# EAGLE design BR110_Roco_43889_PLUX22_J1_007_01_11 (EAGLE 5.10)

## Sheet 1 of 2
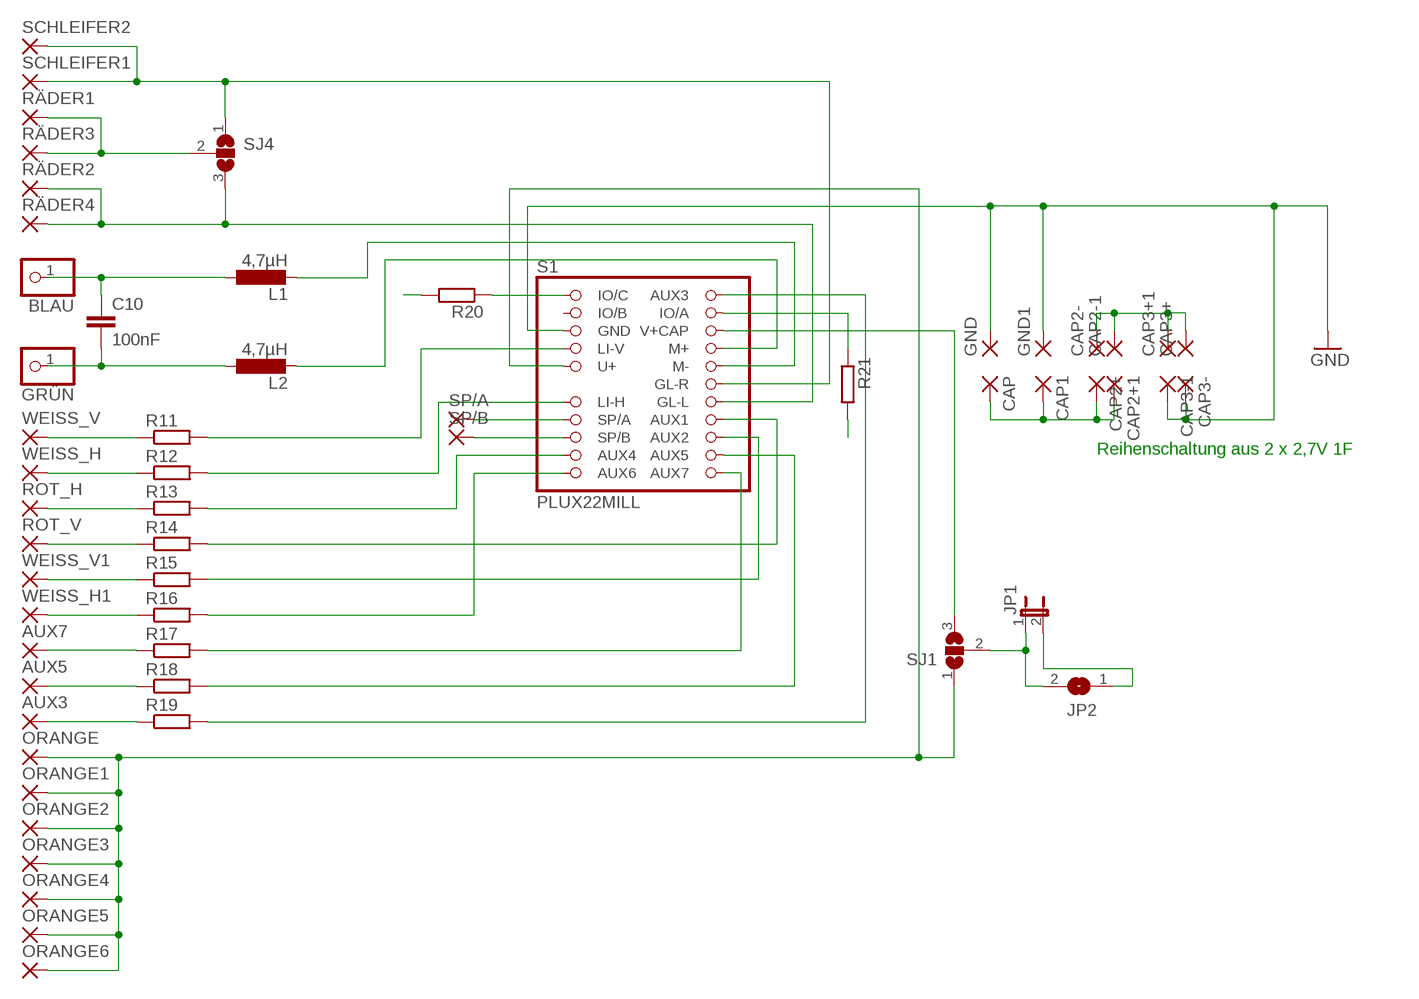
[diagram p0: schematic, sheet 1]

### Parts
AUX3  SMD2  [SMD1,27-2,54]
AUX5  SMD2  [SMD1,27-2,54]
AUX7  SMD2  [SMD1,27-2,54]
BLAU  PINHD-1X1  [1X01]
C10  100nF  C-EUC0603  [C0603]
CAP  SMD2  [SMD1,27-2,54]
CAP1  SMD2  [SMD1,27-2,54]
CAP2+  SMD2  [SMD1,27-2,54]
CAP2+1  SMD2  [SMD1,27-2,54]
CAP2-  SMD2  [SMD1,27-2,54]
CAP2-1  SMD2  [SMD1,27-2,54]
CAP3+  SMD2  [SMD1,27-2,54]
CAP3+1  SMD2  [SMD1,27-2,54]
CAP3-  SMD2  [SMD1,27-2,54]
CAP3-1  SMD2  [SMD1,27-2,54]
GND  SMD2  [SMD1,27-2,54]
GND1  SMD2  [SMD1,27-2,54]
GRÜN  PINHD-1X1  [1X01]
JP1  JP1E2,00  [JP1_2]
JP2  SJ"  [SJ]
L1  4,7µH  L-EUL1212  [L1212]
L2  4,7µH  L-EUL1212  [L1212]
ORANGE  SMD2  [SMD1,27-2,54]
ORANGE1  SMD2  [SMD1,27-2,54]
ORANGE2  SMD2  [SMD1,27-2,54]
ORANGE3  SMD2  [SMD1,27-2,54]
ORANGE4  SMD2  [SMD1,27-2,54]
ORANGE5  SMD2  [SMD1,27-2,54]
ORANGE6  SMD2  [SMD1,27-2,54]
R11  R-EU_R0603S  [R0603S]
R12  R-EU_R0603S  [R0603S]
R13  R-EU_R0603S  [R0603S]
R14  R-EU_R0603S  [R0603S]
R15  R-EU_R0603S  [R0603S]
R16  R-EU_R0603S  [R0603S]
R17  R-EU_R0603S  [R0603S]
R18  R-EU_R0603S  [R0603S]
R19  R-EU_R0603S  [R0603S]
R20  R-EU_R0603S  [R0603S]
R21  R-EU_R0603S  [R0603S]
ROT_H  SMD2  [SMD1,27-2,54]
ROT_V  SMD2  [SMD1,27-2,54]
RÄDER1  SMD2  [SMD1,27-2,54]
RÄDER2  SMD2  [SMD1,27-2,54]
RÄDER3  SMD2  [SMD1,27-2,54]
RÄDER4  SMD2  [SMD1,27-2,54]
S1  PLUX22MILL  [PLUX22_SMD_MILL]
SCHLEIFER1  SMD2  [SMD1,27-2,54]
SCHLEIFER2  SMD2  [SMD1,27-2,54]
SJ1  SJ2W  [SJ_2]
SJ4  SJ2W  [SJ_2]
SP/A  SMD2  [SMD1,27-2,54]
SP/B  SMD2  [SMD1,27-2,54]
WEISS_H  SMD2  [SMD1,27-2,54]
WEISS_H1  SMD2  [SMD1,27-2,54]
WEISS_V  SMD2  [SMD1,27-2,54]
WEISS_V1  SMD2  [SMD1,27-2,54]

### Nets
AUX1: R14.2 S1.P16(AUX1)
AUX2: R15.2 S1.P18(AUX2)
AUX3: R19.2 S1.P2(AUX3)
AUX4: R13.2 S1.P19(AUX4)
AUX5: R18.2 S1.P20(AUX5)
AUX6: R16.2 S1.P21(AUX6)
AUX7: R17.2 S1.P22(AUX7)
BLAU: BLAU.1 C10.1 L1.1
CAP: CAP1.1(P) CAP2+1.1(P) CAP2+.1(P) CAP.1(P) ; also sheet 2
FÜ1: R21.2
FÜ2: R20.2
GND: CAP3-1.1(P) CAP3-.1(P) GND1.1(P) GND.1(P) S1.P5(GND) ; also sheet 2
GRAU: R11.2 S1.P7(LI-V)
GRÜN: C10.2 GRÜN.1 L2.1
IN: JP1.2 JP2.1 ; also sheet 2
N$2: S1.P6(V+CAP) SJ1.3
N$3: AUX7.1(P) R17.1
N$4: AUX5.1(P) R18.1
N$5: AUX3.1(P) R19.1
N$6: R12.2 S1.P13(LI-H)
N$8: R13.1 ROT_H.1(P)
N$9: R14.1 ROT_V.1(P)
N$10: R12.1 WEISS_H.1(P)
N$11: R11.1 WEISS_V.1(P)
N$16: R21.1 S1.P4(IO/A)
N$17: S1.P15(SP/A) SP/A.1(P)
N$18: S1.P17(SP/B) SP/B.1(P)
N$20: R15.1 WEISS_V1.1(P)
N$21: R16.1 WEISS_H1.1(P)
N$22: L2.2 S1.P8(M+)
N$23: L1.2 S1.P10(M-)
N$24: R20.1 S1.P1(IO/C)
N$27: CAP2-1.1(P) CAP2-.1(P) CAP3+1.1(P) CAP3+.1(P)
N$35: JP1.1 JP2.2 SJ1.2
ORANGE: ORANGE1.1(P) ORANGE2.1(P) ORANGE3.1(P) ORANGE4.1(P) ORANGE5.1(P) ORANGE6.1(P) ORANGE.1(P) S1.P9(U+) SJ1.1
RÄDER: RÄDER2.1(P) RÄDER4.1(P) S1.P14(GL-L) SJ4.3
RÄDER2: RÄDER1.1(P) RÄDER3.1(P) SJ4.2
SCHLEIFER: S1.P12(GL-R) SCHLEIFER1.1(P) SCHLEIFER2.1(P) SJ4.1
Unconnected: S1.P3(IO/B)

### Notes on the sheet
- Reihenschaltung aus 2 x 2,7V 1F

## Sheet 2 of 2
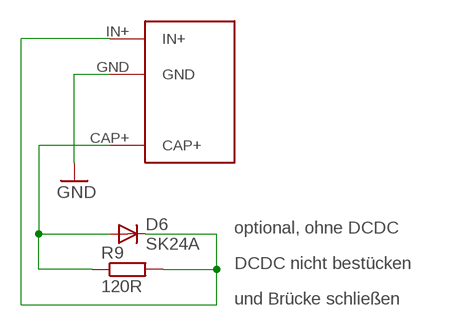
[diagram p1: schematic, sheet 2]

### Parts
D6  SK24A  ES2D  [SMB]
R9  120R  R-EU_R0603  [R0603]
U$1  PWR_CAPT  [POWER_CAP]

### Nets
CAP: D6.A R9.1 U$1.CAP+ ; also sheet 1
GND: U$1.GND ; also sheet 1
IN: D6.C R9.2 U$1.IN+ ; also sheet 1

### Notes on the sheet
- optional, ohne DCDC
- DCDC nicht bestücken
- und Brücke schließen

## Library data of the parts
AUX3 AUX5 AUX7 CAP CAP1 CAP2+ CAP2+1 CAP2- CAP2-1 CAP3+ CAP3+1 CAP3- CAP3-1 GND GND1 ORANGE ORANGE1-ORANGE6 ROT_H ROT_V RÄDER1-RÄDER4 SCHLEIFER1 SCHLEIFER2 SP/A SP/B WEISS_H WEISS_H1 WEISS_V WEISS_V1 = wirepad:SMD2: SMD PAD
BLAU GRÜN = pinhead:PINHD-1X1: PIN HEADER
C10 = rcl:C-EU: CAPACITOR, European symbol
D6 = diode:ES2D: DIODE super fast rectifier, 2 A
JP1 = jumper:JP1E: JUMPER
JP2 = jumper:SJ: SMD solder JUMPER
L1 L2 = rcl:L-EU: INDUCTOR, European symbol
R9 R11-R21 = rcl:R-EU_: RESISTOR, European symbol
S1 = pinhead:PLUX22
SJ1 SJ4 = jumper:SJ2W: SMD solder JUMPER
U$1 = pinhead:PWR_CAP

## Board
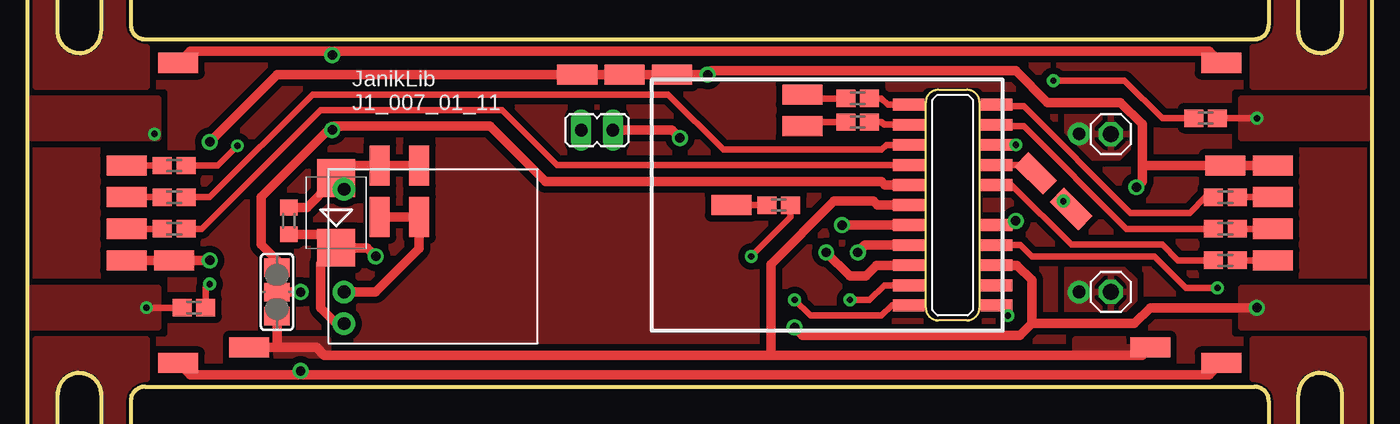
[diagram p2: board, top side]
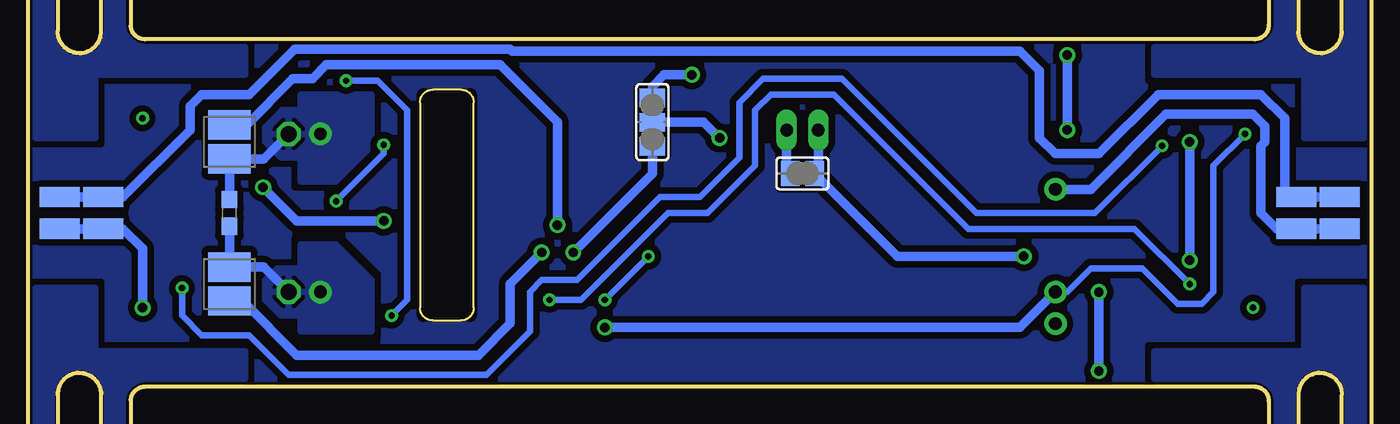
[diagram p3: board, bottom side, seen from below]

No outline drawn. Coordinates in mm, seen from the top.
Copper layers (1*16): Top 0.035mm / dielectric 1.5mm / Bottom 0.035mm
Design rules "default *": minimum track width 10mil, minimum drill 0.4mm, track to track 8mil, track to pad 8mil, pad to pad 8mil, via to via 8mil, smd to smd 8mil, copper to edge 40mil, drill to drill 8mil, minimum pad ring 10mil, minimum via ring 8mil, stop-mask expansion 4mil, vias tented up to drill 0mil, thermal gap 10mil
bKeepout: area 23,3 to 61,25; area 7,3 to 16,25; area 69.5,3 to 78.5,25; area 0,19.2 to 3.8,28; area 3.8,23.2 to 13.2,28; area 0,0 to 3.8,8.8; area 81.2,0 to 85,8.8; area 81.2,19.2 to 85,28; area 3.8,0 to 13.2,4.8; area 71.8,0 to 81.2,4.8; area 71.8,23.2 to 81.2,28
tRestrict: area 57,7.5 to 60,21.5
bRestrict: area 57,7.5 to 60,21.5
Milling: 36 lines

### Footprints (pad centres in the part's own frame; a part is rotated, then mirrored left to right if it is on the bottom)
SMD1,27-2,54 = smd 1.27 x 2.54: 1 0,0
1X01 = drill 1.016 octagon: 1 0,0
C0603 = smd 1.1 x 1: 1 -0.85,0; 2 0.85,0
SMB = smd 2.4 x 2.4: A 2.2,0; C -2.2,0
JP1_2 = drill 0.8 long: 1 0,-1; 2 0,1
SJ = smd 1.168 x 1.6: 1 -0.762,0; 2 0.762,0
L1212 = smd 1.85 x 2.7: 1 -1.075,0; 2 1.075,0
R0603 = smd 1 x 1.1: 1 -0.85,0; 2 0.85,0
R0603S = smd 1.2 x 1.1: 1 -0.75,0; 2 0.75,0
PLUX22_SMD_MILL = smd 0.75 x 2: P1 -6.35,-2.792; P2 -6.35,2.792; P3 -5.08,-2.792; P4 -5.08,2.792; P5 -3.81,-2.792; P6 -3.81,2.792; P7 -2.54,-2.792; P8 -2.54,2.792; P9 -1.27,-2.792; P10 -1.27,2.792; P12 0,2.792; P13 1.27,-2.792; P14 1.27,2.792; P15 2.54,-2.792; P16 2.54,2.792; P17 3.81,-2.792; P18 3.81,2.792; P19 5.08,-2.792; P20 5.08,2.792; P21 6.35,-2.792; P22 6.35,2.792
SJ_2 = smd 1.168 x 1.6: 1 -1.524,0; 2 0,0; 3 1.524,0
POWER_CAP = drill 0.8 pad 1.422 round: CAP+ 0,-6.5; GND 0,0; IN+ 0,2

### Placement (x,y rotation side)
AUX3  44.5,14.5 90 top
AUX5  49,19.5 90 top
AUX7  49,21.5 90 top
BLAU  68.5,19 0 top
C10  72.25,14 270 bottom
CAP  22.25,17 0 top
CAP1  24.75,17 0 top
CAP2+  2,13 90 bottom
CAP2+1  4.75,13 270 bottom
CAP2-  2,15 90 bottom
CAP2-1  4.75,15 270 bottom
CAP3+  83,15 90 bottom
CAP3+1  80.25,15 270 bottom
CAP3-  83,13 90 bottom
CAP3-1  80.25,13 270 bottom
D6  19.5,14 90 top
GND  24.75,13.75 0 top
GND1  22.25,13.75 0 top
GRÜN  68.5,9 0 top
JP1  36,19.25 90 top
JP2  36,16.5 180 bottom
L1  72.25,18.5 90 bottom
L2  72.25,9.5 270 bottom
ORANGE  6.25,11 270 top
ORANGE1  9.25,11 270 top
ORANGE2  78.75,17 270 top
ORANGE3  75.75,17 270 top
ORANGE4  34.75,22.75 90 top
ORANGE5  37.75,22.75 90 top
ORANGE6  40.75,22.75 90 top
R9  16.5,13.5 270 top
R11  9.25,17 0 top
R12  75.75,11 180 top
R13  75.75,13 180 top
R14  9.25,13 0 top
R15  9.25,15 0 top
R16  75.75,15 180 top
R17  52.5,21.25 0 top
R18  52.5,19.75 0 top
R19  47.5,14.5 0 top
R20  74.5,20 0 top
R21  10.5,8 180 top
ROT_H  78.75,13 270 top
ROT_V  6.25,13 270 top
RÄDER1  9.5,4.5 90 top
RÄDER2  9.5,23.5 90 top
RÄDER3  75.5,4.5 90 top
RÄDER4  75.5,23.5 90 top
S1  58.5,14.5 90 top
SCHLEIFER1  14,5.5 90 top
SCHLEIFER2  71,5.5 90 top
SJ1  45.5,19.75 270 bottom
SJ4  15.75,9 90 top
SP/A  63.75,16.5 45 top
SP/B  66,14.25 45 top
U$1  20,9 180 top
WEISS_H  78.75,11 270 top
WEISS_H1  78.75,15 270 top
WEISS_V  6.25,17 270 top
WEISS_V1  6.25,15 270 top

### Tracks (layer width: path | path; a pad name or v marks a point on that pad's centre or on a via)
AUX1
  Top 0.406: R14.2 11,13 18.5,20.5 30,20.5 33.46,17.04 S1.P16
AUX2
  Top 0.406: R15.2 11.5,15 18,21.5 40.5,21.5 44,18 54,18 54.31,18.31 S1.P18
AUX3  (via drill 0.4)
  Top 0.406: S1.P2 54.65,8.15 54,7.5 49.5,7.5 v48.5,8.5 | v45.75,11.25 48.25,13.75 R19.2
  Bottom 0.406: v48.5,8.5 v45.75,11.25
AUX4
  Top 0.406: S1.P19 61.37,19.5 63,19.5 69.5,13 R13.2
AUX5
  Top 0.406: S1.P20 54.17,19.58 54,19.75 R18.2
AUX6
  Top 0.406: S1.P21 61.39,20.75 63,20.75 69.75,14 73.5,14 74.5,15 R16.2
AUX7
  Top 0.406: S1.P22 54.4,20.85 54,21.25 R17.2
BLAU  (via drill 0.8 pad 1.42)
  Bottom 0.61: BLAU.1 70.08,17.43 L1.1 C10.1
  other vias: 66.5,19
  pour Top (isolate 0.406): 65.75,17.5 69,17.5 70,18.5 70,19.5 69,20.5 65.75,20.5
  pour Bottom (isolate 0.406): 67.75,16 67.75,17.5 69,17.5 70,18.5 70,19.5 69,20.5 67.75,20.5 67.75,21.5 63.25,21.5 63.25,18.25 65.5,16
CAP
  Top 0.61: 19.15,15.85 D6.A 20.3,17 CAP.1 CAP1.1 | U$1.CAP+ 19.5,15.5 19.15,15.85 | 19.15,15.85 17.65,14.35 R9.1
  Bottom 0.61: CAP2+.1 CAP2+1.1 6,13 7,14 7,18.25 6.75,18.5 6.75,19.5 7.5,20.25 13,20.25 17.75,15.5 U$1.CAP+
FÜ1  (via drill 0.4)
  Top 0.406: v7.5,8 R21.2
  pour Top: 8.25,9.25 0.25,9.25 0.25,6.75 8.25,6.75
FÜ2  (via drill 0.4)
  Top 0.406: R20.2 v77.75,20
  pour Top: 84.75,21.25 76.75,21.25 76.75,18.75 84.75,18.75
GND  (via drill 0.4, 0.6)
  Top 0.61: S1.P5 62.56,10.69 63.5,9.75 63.5,7 | 63.5,7 62.75,6.25 49,6.25 v48.5,6.75 | v77.75,8 71,8 70,7 63.5,7 | GND1.1 GND.1 24.75,11.75 22,9 U$1.GND
  Bottom 0.406: v8,19 10,17 10,9 10.75,8.25 12.25,8.25 14.5,10.5 17.75,10.5 19.25,9 U$1.GND
  Bottom 0.61: v77.75,8 77.75,11.75 79,13 CAP3-1.1 CAP3-.1 | U$1.GND 22.25,6.75 v48.5,6.75
  pour Top: 84.75,9.25 76.75,9.25 76.75,6.75 84.75,6.75
  pour Top: 8.25,21.25 0.25,21.25 0.25,18.75 8.25,18.75
GRAU  (via drill 0.4)
  Top 0.406: v13.25,18.25 12,17 R11.2 | S1.P7 62.79,11.96 63.5,11.25 71.25,11.25 73.25,9.25 v75.25,9.25
  Bottom 0.406: v13.25,18.25 17.5,14 25,14 33.5,22.5 38.5,22.5 40,21 40,17.5 42.5,15 45,15 50.25,9.75 52.5,9.75 53.25,9 53.25,6.5 56,3.75 68.5,3.75 71,6.25 74,6.25 75.25,7.5 v75.25,9.25
GRÜN  (via drill 0.8 pad 1.42)
  Bottom 0.61: GRÜN.1 70.08,10.57 L2.1 C10.2
  other vias: 66.5,9
  pour Top (isolate 0.406): 65.75,7.5 69,7.5 70,8.5 70,9.75 69.25,10.5 65.75,10.5
  pour Bottom (isolate 0.406): 67.75,6.5 67.75,7.5 69,7.5 70,8.5 70,9.75 69.25,10.5 67.75,10.5 67.75,12 65.5,12 63.25,9.75 63.25,6.5
IN  (via drill 0.6)
  Top 0.61: D6.C 19.5,12.5 | D6.C 20.2,12.5 | v22,11.25 21.45,11.8 D6.C | U$1.IN+ 19.5,7 18.5,8 18.5,10.8 D6.C | R9.2 18.65,12.65 D6.C
  Bottom 0.61: JP1.2 35,16.74 JP2.1 29.99,11.25 v22,11.25
N$2  (via drill 0.6)
  Top 0.61: S1.P6 53.69,10.69 53,10 52,10 v50.5,11.5
  Bottom 0.61: v50.5,11.5 45.5,16.5 SJ1.3
N$3
  Top 0.406: R17.1 49.25,21.25 AUX7.1
N$4
  Top 0.406: R18.1 49.25,19.75 AUX5.1
N$5
  Top 0.406: AUX3.1 R19.1
N$6
  Top 0.406: R12.2 72.75,11 71.75,12 66,12 62.23,15.77 S1.P13
N$7
  pour Top (isolate 0.406): 1.5,27.5 0.5,27.5 0.5,22 7.5,22 7.5,24.5 arc-90 6,26 6,27.5 5,27.5 5,25.5 arc-90 3.25,23.75 arc-90 1.5,25.5
  pour Top (isolate 0.406): 83.5,0.5 84.5,0.5 84.5,6 77.5,6 77.5,3.5 arc-90 79,2 79,0.5 80,0.5 80,2.5 arc-90 81.75,4.25 arc-90 83.5,2.5
  pour Bottom (isolate 0.406): 1.5,0.5 0.5,0.5 0.5,9.25 4.25,9.25 4.25,5.25 13.75,5.25 13.75,3.5 7.5,3.5 arc90 6,2 6,0.5 5,0.5 5,2.5 arc90 3.25,4.25 arc90 1.5,2.5
  pour Bottom (isolate 0.406): 1.5,27.5 0.5,27.5 0.5,18.75 4.25,18.75 4.25,22.75 13.75,22.75 13.75,24.5 7.5,24.5 arc-90 6,26 6,27.5 5,27.5 5,25.5 arc-90 3.25,23.75 arc-90 1.5,25.5
  pour Bottom (isolate 0.406): 83.5,27.5 84.5,27.5 84.5,18.75 80.75,18.75 80.75,22.75 71.25,22.75 71.25,24.5 77.5,24.5 arc90 79,26 79,27.5 80,27.5 80,25.5 arc90 81.75,23.75 arc90 83.5,25.5
  pour Bottom (isolate 0.406): 83.5,0.5 84.5,0.5 84.5,9.25 80.75,9.25 80.75,5.25 71.25,5.25 71.25,3.5 77.5,3.5 arc-90 79,2 79,0.5 80,0.5 80,2.5 arc-90 81.75,4.25 arc-90 83.5,2.5
N$8
  Top 0.406: R13.1 ROT_H.1
N$9
  Top 0.406: ROT_V.1 R14.1
N$10
  Top 0.406: R12.1 WEISS_H.1
N$11
  Top 0.406: WEISS_V.1 R11.1
N$13
  pour Top (isolate 0.406, rank 2): 6,27.5 5,27.5 5,25.5 arc-90 3.25,23.75 arc-90 1.5,25.5 1.5,27.5 0.5,27.5 0.5,0.5 1.5,0.5 1.5,2.5 arc-90 3.25,4.25 arc-90 5,2.5 5,0.5 6,0.5 6,2 arc-90 7.5,3.5 77.5,3.5 arc-90 79,2 79,0.5 80,0.5 80,2.5 arc-90 81.75,4.25 arc-90 83.5,2.5 83.5,0.5 84.5,0.5 84.5,27.5 83.5,27.5 83.5,25.5 arc-90 81.75,23.75 arc-90 80,25.5 80,27.5 79,27.5 79,26 arc-90 77.5,24.5 7.5,24.5 arc-90 6,26
  pour Bottom (isolate 0.406, rank 2): 71.25,22.75 71.25,24.5 13.75,24.5 13.75,22.75 4.25,22.75 4.25,18.75 0.5,18.75 0.5,9.25 4.25,9.25 4.25,5.25 13.75,5.25 13.75,3.5 71.25,3.5 71.25,5.25 80.75,5.25 80.75,9.25 84.5,9.25 84.5,18.75 80.75,18.75 80.75,22.75
N$14
  pour Top (isolate 0.406): 83.5,27.5 84.5,27.5 84.5,22 77.5,22 77.5,24.5 arc90 79,26 79,27.5 80,27.5 80,25.5 arc90 81.75,23.75 arc90 83.5,25.5
N$15
  pour Top (isolate 0.406): 1.5,0.5 0.5,0.5 0.5,6 7.5,6 7.5,3.5 arc90 6,2 6,0.5 5,0.5 5,2.5 arc90 3.25,4.25 arc90 1.5,2.5
N$16  (via drill 0.4)
  Top 0.406: v11.5,9.5 11.25,9.25 R21.1 | S1.P4 54.17,9.42 53.25,8.5 v52,8.5
  Bottom 0.406: v52,8.5 50,8.5 44.5,14 42,14 39,17 39,20.5 38,21.5 34,21.5 25.5,13 15,13 v11.5,9.5
N$17
  Top 0.406: S1.P15 63.21,17.04 SP/A.1
N$18  (via drill 0.4)
  Top 0.406: v62.5,18.31 S1.P17 | SP/B.1 v65.5,14.75
  Bottom 0.406: v65.5,14.75 62.5,17.75 v62.5,18.31
N$20
  Top 0.406: WEISS_V1.1 R15.1
N$21
  Top 0.406: R16.1 WEISS_H1.1
N$22  (via drill 0.6)
  Top 0.61: S1.P8 52.96,11.96 v52.5,11.5
  Bottom 0.61: v52.5,11.5 54.5,9.5 54.5,7 56.5,5 68,5 71.42,8.43 L2.2
N$23  (via drill 0.6)
  Top 0.61: v51.5,13.23 S1.P10
  Bottom 0.61: v51.5,13.23 51.5,19.75 55.12,23.38 66.12,23.38 67,22.5 68.25,22.5 71.17,19.57 L1.2
N$24  (via drill 0.4)
  Top 0.406: S1.P1 61.35,8.15 v62,7.5 | R20.1 71.75,20 69.38,22.38 v64.88,22.38
  Bottom 0.406: v62,7.5 61,8.5 61,20.5 62.88,22.38 v64.88,22.38
N$27
  Bottom 0.61: CAP2-.1 CAP2-1.1 5.5,15 5.5,20 7,21.5 13.5,21.5 17.25,17.75 20,17.75 21,18.75 21,23 22.25,24.25 54.38,24.25 54.5,24.38 68.12,24.38 71,21.5 74,21.5 74.75,20.75 74.75,19.25 79,15 CAP3+1.1 CAP3+.1
N$35  (via drill 0.6)
  Top 0.61: JP1.1 40.75,19.25 v41.25,18.75
  Bottom 0.61: SJ1.2 42.25,19.75 v41.25,18.75 | JP2.2 37,16.74 JP1.1
ORANGE  (via drill 0.6)
  Top 0.61: S1.P9 62.23,13.23 v62.5,13.5 | ORANGE.1 ORANGE1.1 v11.5,11 | ORANGE2.1 ORANGE3.1 70.5,17 | 70.5,17 70.5,19.62 69.12,21 64.5,21 62.5,23 43.25,23 43.01,22.75 v43,22.75 ORANGE6.1 ORANGE5.1 ORANGE4.1 15.75,22.75 v11.5,18.5 | 70.5,17 70.5,16 v70.12,15.62
  Bottom 0.61: v70.12,15.62 68,13.5 v62.5,13.5 | v11.5,11 v11.5,18.5 | v43,22.75 44.75,22.75 45.5,22 SJ1.1
RÄDER  (via drill 0.6)
  Top 0.61: 19.25,19.5 29.25,19.5 32.75,16 54,16 54.23,15.77 S1.P14 | SJ4.3 15.75,11 14.75,12 14.75,15 19.25,19.5 | RÄDER2.1 10.25,24.25 19.25,24.25 | RÄDER4.1 74.75,24.25 19.25,24.25 | v19.25,24 19.25,24.25 | 19.25,19.5 v19.25,19.25
  Bottom 0.61: v19.25,19.25 v19.25,24
RÄDER2  (via drill 0.6)
  Top 0.61: RÄDER1.1 10.25,3.75 17.25,3.75 | RÄDER3.1 74.75,3.75 17.25,3.75 | v17.25,9 SJ4.2 | 17.25,3.75 v17.25,4
  Bottom 0.61: v17.25,4 v17.25,9
SCHLEIFER
  Top 0.61: 47,5 70.5,5 SCHLEIFER2.1 | SCHLEIFER1.1 15.75,5.5 | 15.75,5.5 18.25,5.5 18.75,5 47,5 | 47,5 47,10.75 51,14.75 53.5,14.75 53.75,14.5 S1.P12 | 15.75,5.5 SJ4.1
  pour Top (isolate 0.406): 70,5 66.25,5 66.25,6 70,6
  pour Top (isolate 0.406): 19,5 15.25,5 15.25,6 19,6

### Text on the board
tNames: JanikLib | J1_007_01_11
tStop: Fü2 +5V | GND | Rad1 | AUX7 | Rad1 | AUX5 | CAP+ | plus | weiss | AUX6 | AUX3 | AUX2 | GND | AUX4 | AUX1 | weiss | plus | AC | DC | Rad2 | U+ | Rad2 | GND | Fü1 +5V | Schl. | Schl.
bStop: V+ | CAP- | Cap | CAP+ | CAP+ | Roco 43889 | PLUX22 | CAP- | BR110 PLUX22 | design by Janik Merz